# EAGLE schematic module (EAGLE 9.6.0)
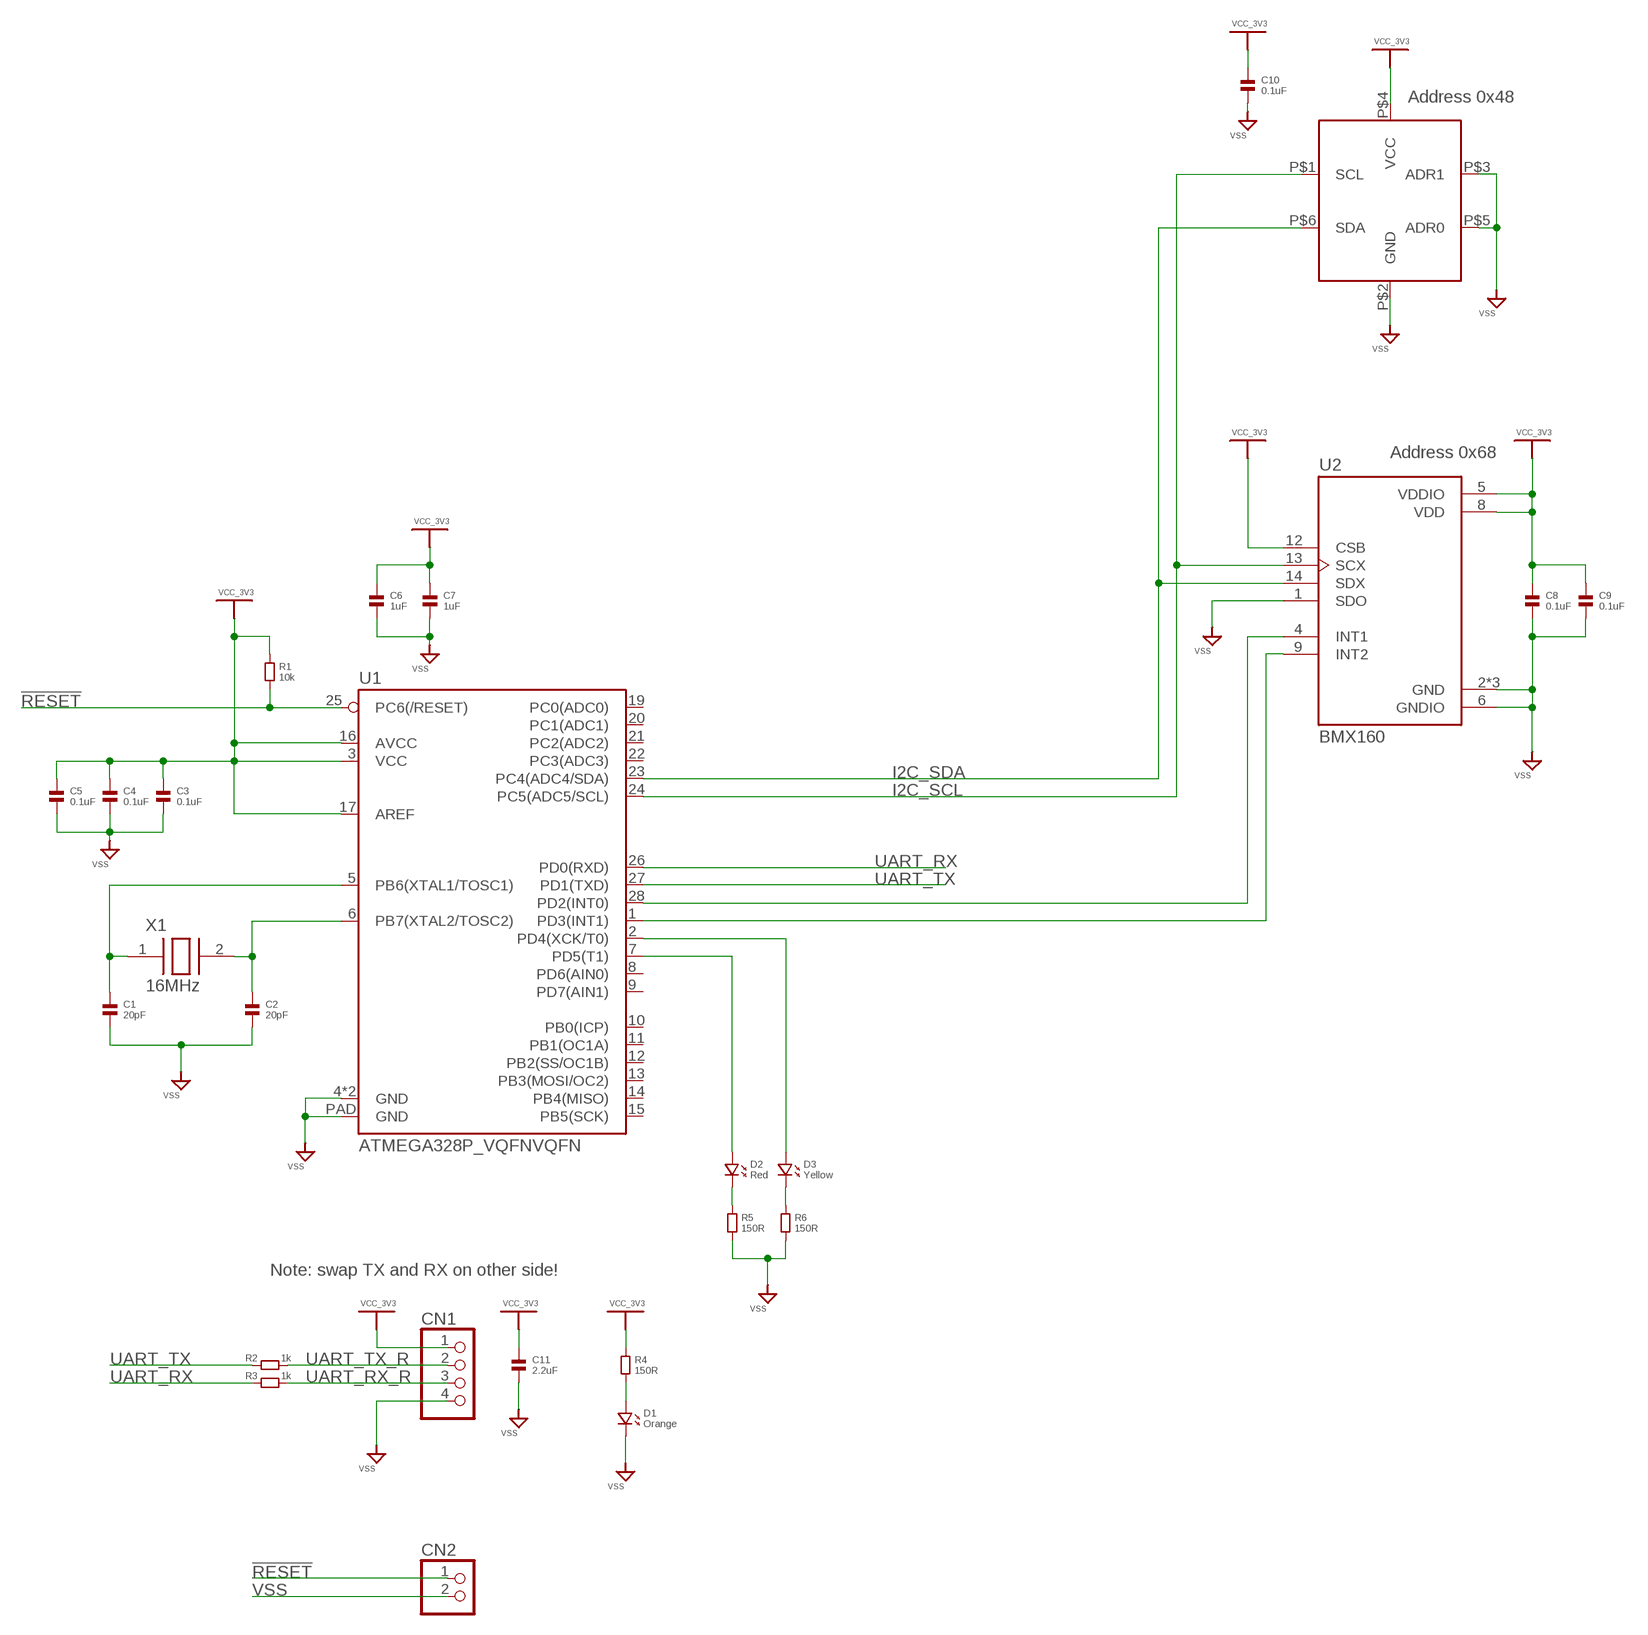
[diagram p0: schematic, sheet 1]

## Parts
C1  20pF  CAPACITOR.0402  [0402]
C2  20pF  CAPACITOR.0402  [0402]
C3  0.1uF  CAPACITOR.0402  [0402]
C4  0.1uF  CAPACITOR.0402  [0402]
C5  0.1uF  CAPACITOR.0402  [0402]
C6  1uF  CAPACITOR.0603  [0603]
C7  1uF  CAPACITOR.0603  [0603]
C8  0.1uF  CAPACITOR.0402  [0402]
C9  0.1uF  CAPACITOR.0402  [0402]
C10  0.1uF  CAPACITOR.0402  [0402]
C11  2.2uF  CAPACITOR.0603  [0603]
CN1  JST_4PIN  [JSTPH4]
CN2  JST_2PIN  [JSTPH2]
D1  Orange  LED.0603  [0603.LED]
D2  Red  LED.0603  [0603.LED]
D3  Yellow  LED.0603  [0603.LED]
R1  10k  RESISTOR.0402  [0402]
R2  1k  RESISTOR.0402  [0402]
R3  1k  RESISTOR.0402  [0402]
R4  150R  RESISTOR.0402  [0402]
R5  150R  RESISTOR.0402  [0402]
R6  150R  RESISTOR.0402  [0402]
U1  ATMEGA328P_VQFNVQFN  [VQFN-28]
U2  BMX160  [PQFN50P250X300X100-14N]
U$1  TMP100  [SOT23-6]
X1  16MHz  ECS_INC-OSCILLATOR-ECS-160-20-23A-TR  [ECS_INC-OSCILLATOR-ECS-160-20-23A-TR]

## Nets
!RESET: CN2.1 R1.2 U1.25(PC6(/RESET))
I2C_SCL: U1.24(PC5(ADC5/SCL)) U2.13(SCX) U$1.P$1(SCL)
I2C_SDA: U1.23(PC4(ADC4/SDA)) U2.14(SDX) U$1.P$6(SDA)
N$1: C1.1 U1.5(PB6(XTAL1/TOSC1)) X1.1(XI)
N$2: C2.1 U1.6(PB7(XTAL2/TOSC2)) X1.2(XO)
N$3: U1.28(PD2(INT0)) U2.4(INT1)
N$4: U1.1(PD3(INT1)) U2.9(INT2)
N$5: D1.P$1 R4.2
N$6: D3.P$2 R6.1
N$7: D2.P$2 R5.1
N$8: D2.P$1 U1.7(PD5(T1))
N$9: D3.P$1 U1.2(PD4(XCK/T0))
UART_RX: R3.1 U1.26(PD0(RXD))
UART_RX_R: CN1.3 R3.2
UART_TX: R2.1 U1.27(PD1(TXD))
UART_TX_R: CN1.2 R2.2
VCC_3V3: C3.1 C4.1 C5.1 C6.1 C7.1 C8.1 C9.1 C10.1 C11.1 CN1.1 R1.1 R4.1 U1.3(VCC) U1.16(AVCC) U1.17(AREF) U2.5(VDDIO) U2.8(VDD) U2.12(CSB) U$1.P$4(VCC)
VSS: C1.2 C2.2 C3.2 C4.2 C5.2 C6.2 C7.2 C8.2 C9.2 C10.2 C11.2 CN1.4 CN2.2 D1.P$2 R5.2 R6.2 U1.4(GND) U1.18(GND) U1.PAD(GND) U2.1(SDO) U2.2(GND) U2.3(GND) U2.6(GNDIO) U2.7(GND) U$1.P$2(GND) U$1.P$3(ADR1) U$1.P$5(ADR0)
Unconnected: U1.8(PD6(AIN0)) U1.9(PD7(AIN1)) U1.10(PB0(ICP)) U1.11(PB1(OC1A)) U1.12(PB2(SS/OC1B)) U1.13(PB3(MOSI/OC2)) U1.14(PB4(MISO)) U1.15(PB5(SCK)) U1.19(PC0(ADC0)) U1.20(PC1(ADC1)) U1.21(PC2(ADC2)) U1.22(PC3(ADC3))

## Notes on the sheet
- Address 0x48
- Address 0x68
- Note: swap TX and RX on other side!

## Library data of the parts
C1-C11 = standardparts:CAPACITOR
CN1 = microbuilder:JST_4PIN: JST 4-Pin Right-Angle Connector 4UConnector: 17312
CN2 = microbuilder:JST_2PIN: JST 2-Pin Right-Angle Connector PH-Series - 4UConnector: 17311 SH-Series - 4UConnector: 07278
D1-D3 = standardparts:LED
R1-R6 = standardparts:RESISTOR
U1 = SparkFun-IC-Microcontroller:ATMEGA328P_VQFN: Atmel 328P QFN part not in catalog
U2 = BMX160:BMX160: IMU ACCEL/GYRO/MAG; AVAILABILITY: Unavailable; DESCRIPTION: IMU ACCEL/GYRO/MAG; MF: Bosch Sensortec; MP: BMX160; PACKAGE: VFLGA-14 Bosch Sensortec; PRICE: None
U$1 = tmp10x:TMP100: Digital Temperature sensor from Texas Instruments Digital output : I2C Resolution : 9 to 12bit Accuracy : 2'C from -25'C to 85'C ; 3'C from -55'C to 125'C Supply : 2,7 to 5,5V / 45uA (standby 0,1uA)
X1 = Module_ICs:ECS_INC-OSCILLATOR-ECS-160-20-23A-TR